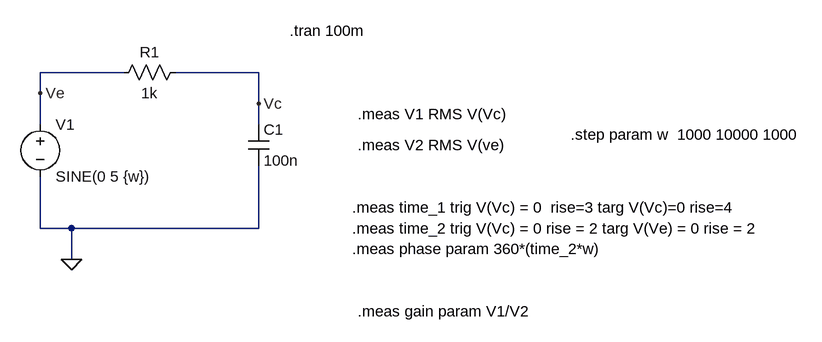
[diagram p0: schematic Exp6-RC.asc]
Exp6-RC.asc, the LTspice schematic file:
Version 4
SHEET 1 1292 680
WIRE 144 176 16 176
WIRE 352 176 224 176
WIRE 16 208 16 176
WIRE 352 224 352 176
WIRE 16 256 16 208
WIRE 352 256 352 224
WIRE 16 416 16 336
WIRE 64 416 16 416
WIRE 352 416 352 320
WIRE 352 416 64 416
WIRE 64 464 64 416
FLAG 64 464 0
FLAG 16 208 Ve
FLAG 352 224 Vc
SYMBOL voltage 16 240 R0
SYMATTR InstName V1
SYMATTR Value SINE(0 5 {w})
SYMBOL res 240 160 R90
WINDOW 0 0 56 VBottom 2
WINDOW 3 32 56 VTop 2
SYMATTR InstName R1
SYMATTR Value 1k
SYMBOL cap 336 256 R0
SYMATTR InstName C1
SYMATTR Value 100n
TEXT 832 272 Left 2 !.step param w  1000 10000 1000
TEXT 400 112 Left 2 !.tran 100m
TEXT 504 240 Left 2 !.meas V1 RMS V(Vc)
TEXT 504 288 Left 2 !.meas V2 RMS V(ve)
TEXT 496 384 Left 2 !.meas time_1 trig V(Vc) = 0  rise=3 targ V(Vc)=0 rise=4
TEXT 496 416 Left 2 !.meas time_2 trig V(Vc) = 0 rise = 2 targ V(Ve) = 0 rise = 2
TEXT 496 448 Left 2 !.meas phase param 360*(time_2*w)
TEXT 504 544 Left 2 !.meas gain param V1/V2

The netlist it stands for:
* Exp6-RC.asc
V1 Ve 0 SINE(0 5 {w})
R1 Vc Ve 1k
C1 Vc 0 100n
.step param w  1000 10000 1000
.tran 100m
.meas V1 RMS V(Vc)
.meas V2 RMS V(ve)
.meas time_1 trig V(Vc) = 0  rise=3 targ V(Vc)=0 rise=4
.meas time_2 trig V(Vc) = 0 rise = 2 targ V(Ve) = 0 rise = 2
.meas phase param 360*(time_2*w)
.meas gain param V1/V2
.backanno
.end